# Altium schematic sheet config-ground.SchDoc: Config FPGA - Ground
size Legal; CheckedBy: J. Brinton; CompanyName: Signal Laboratories, Inc.; DrawnBy: J. Brinton; Engineer: J. Brinton; Address1: 3479 Edison Way; Address2: Menlo Park CA 94025; Address3: +1 (877) 778-8435; Address4: siglabs.com; DocumentNumber: 20; Revision: 2b; SheetNumber: 21; SheetTotal: 58
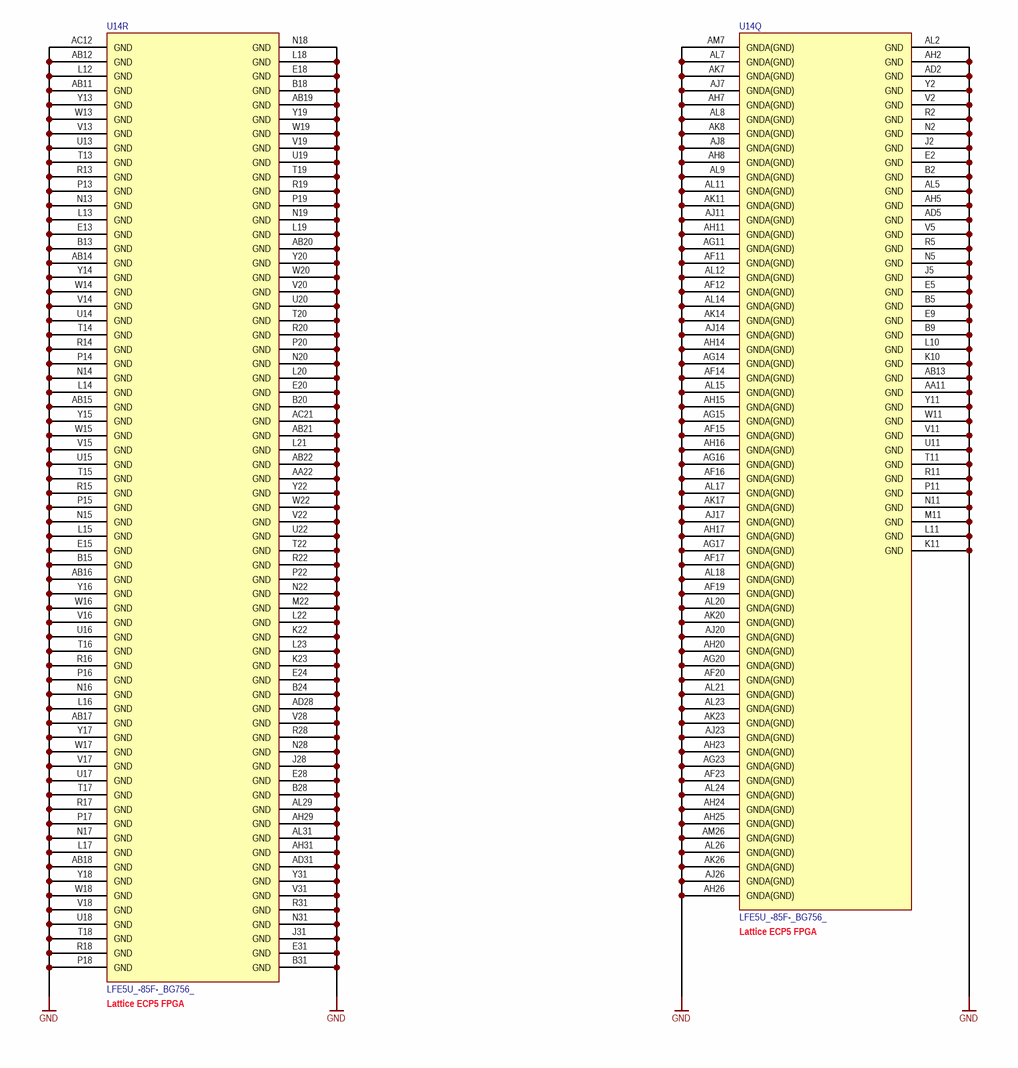
[diagram p0: config-ground.SchDoc]

## Parts
U14  LFE5U_-85F-_BG756_  [caBGA756]  (parts Q,R of 19)

## Nets
GND: U14.AA11(GND) U14.AA22(GND) U14.AB11(GND) U14.AB12(GND) U14.AB13(GND) U14.AB14(GND) U14.AB15(GND) U14.AB16(GND) U14.AB17(GND) U14.AB18(GND) U14.AB19(GND) U14.AB20(GND) U14.AB21(GND) U14.AB22(GND) U14.AC12(GND) U14.AC21(GND) U14.AD2(GND) U14.AD5(GND) U14.AD28(GND) U14.AD31(GND) U14.AF11(GNDA(GND)) U14.AF12(GNDA(GND)) U14.AF14(GNDA(GND)) U14.AF15(GNDA(GND)) U14.AF16(GNDA(GND)) U14.AF17(GNDA(GND)) U14.AF19(GNDA(GND)) U14.AF20(GNDA(GND)) U14.AF23(GNDA(GND)) U14.AG11(GNDA(GND)) U14.AG14(GNDA(GND)) U14.AG15(GNDA(GND)) U14.AG16(GNDA(GND)) U14.AG17(GNDA(GND)) U14.AG20(GNDA(GND)) U14.AG23(GNDA(GND)) U14.AH2(GND) U14.AH5(GND) U14.AH7(GNDA(GND)) U14.AH8(GNDA(GND)) U14.AH11(GNDA(GND)) U14.AH14(GNDA(GND)) U14.AH15(GNDA(GND)) U14.AH16(GNDA(GND)) U14.AH17(GNDA(GND)) U14.AH20(GNDA(GND)) U14.AH23(GNDA(GND)) U14.AH24(GNDA(GND)) U14.AH25(GNDA(GND)) U14.AH26(GNDA(GND)) U14.AH29(GND) U14.AH31(GND) U14.AJ7(GNDA(GND)) U14.AJ8(GNDA(GND)) U14.AJ11(GNDA(GND)) U14.AJ14(GNDA(GND)) U14.AJ17(GNDA(GND)) U14.AJ20(GNDA(GND)) U14.AJ23(GNDA(GND)) U14.AJ26(GNDA(GND)) U14.AK7(GNDA(GND)) U14.AK8(GNDA(GND)) U14.AK11(GNDA(GND)) U14.AK14(GNDA(GND)) U14.AK17(GNDA(GND)) U14.AK20(GNDA(GND)) U14.AK23(GNDA(GND)) U14.AK26(GNDA(GND)) U14.AL2(GND) U14.AL5(GND) U14.AL7(GNDA(GND)) U14.AL8(GNDA(GND)) U14.AL9(GNDA(GND)) U14.AL11(GNDA(GND)) U14.AL12(GNDA(GND)) U14.AL14(GNDA(GND)) U14.AL15(GNDA(GND)) U14.AL17(GNDA(GND)) U14.AL18(GNDA(GND)) U14.AL20(GNDA(GND)) U14.AL21(GNDA(GND)) U14.AL23(GNDA(GND)) U14.AL24(GNDA(GND)) U14.AL26(GNDA(GND)) U14.AL29(GND) U14.AL31(GND) U14.AM7(GNDA(GND)) U14.AM26(GNDA(GND)) U14.B2(GND) U14.B5(GND) U14.B9(GND) U14.B13(GND) U14.B15(GND) U14.B18(GND) U14.B20(GND) U14.B24(GND) U14.B28(GND) U14.B31(GND) U14.E2(GND) U14.E5(GND) U14.E9(GND) U14.E13(GND) U14.E15(GND) U14.E18(GND) U14.E20(GND) U14.E24(GND) U14.E28(GND) U14.E31(GND) U14.J2(GND) U14.J5(GND) U14.J28(GND) U14.J31(GND) U14.K10(GND) U14.K11(GND) U14.K22(GND) U14.K23(GND) U14.L10(GND) U14.L11(GND) U14.L12(GND) U14.L13(GND) U14.L14(GND) U14.L15(GND) U14.L16(GND) U14.L17(GND) U14.L18(GND) U14.L19(GND) U14.L20(GND) U14.L21(GND) U14.L22(GND) U14.L23(GND) U14.M11(GND) U14.M22(GND) U14.N2(GND) U14.N5(GND) U14.N11(GND) U14.N13(GND) U14.N14(GND) U14.N15(GND) U14.N16(GND) U14.N17(GND) U14.N18(GND) U14.N19(GND) U14.N20(GND) U14.N22(GND) U14.N28(GND) U14.N31(GND) U14.P11(GND) U14.P13(GND) U14.P14(GND) U14.P15(GND) U14.P16(GND) U14.P17(GND) U14.P18(GND) U14.P19(GND) U14.P20(GND) U14.P22(GND) U14.R2(GND) U14.R5(GND) U14.R11(GND) U14.R13(GND) U14.R14(GND) U14.R15(GND) U14.R16(GND) U14.R17(GND) U14.R18(GND) U14.R19(GND) U14.R20(GND) U14.R22(GND) U14.R28(GND) U14.R31(GND) U14.T11(GND) U14.T13(GND) U14.T14(GND) U14.T15(GND) U14.T16(GND) U14.T17(GND) U14.T18(GND) U14.T19(GND) U14.T20(GND) U14.T22(GND) U14.U11(GND) U14.U13(GND) U14.U14(GND) U14.U15(GND) U14.U16(GND) U14.U17(GND) U14.U18(GND) U14.U19(GND) U14.U20(GND) U14.U22(GND) U14.V2(GND) U14.V5(GND) U14.V11(GND) U14.V13(GND) U14.V14(GND) U14.V15(GND) U14.V16(GND) U14.V17(GND) U14.V18(GND) U14.V19(GND) U14.V20(GND) U14.V22(GND) U14.V28(GND) U14.V31(GND) U14.W11(GND) U14.W13(GND) U14.W14(GND) U14.W15(GND) U14.W16(GND) U14.W17(GND) U14.W18(GND) U14.W19(GND) U14.W20(GND) U14.W22(GND) U14.Y2(GND) U14.Y11(GND) U14.Y13(GND) U14.Y14(GND) U14.Y15(GND) U14.Y16(GND) U14.Y17(GND) U14.Y18(GND) U14.Y19(GND) U14.Y20(GND) U14.Y22(GND) U14.Y31(GND)

## Notes on the sheet
- (near U14) Lattice ECP5 FPGA
- Title
- Engineer
- Revision
- Drawn By
- Checked By
- Date
- Sheet
- of

## Library data of the parts
U14 = LFE5U_-85F-_BG756_: ECP5 FPGA, 85k LUT, 756-caBGA; Manufacturer: Lattice Semiconductor; Manufacturer P/N: LFE5U_-85F-_BG756_